# Altium schematic sheet LCD1602.SchDoc
size A3
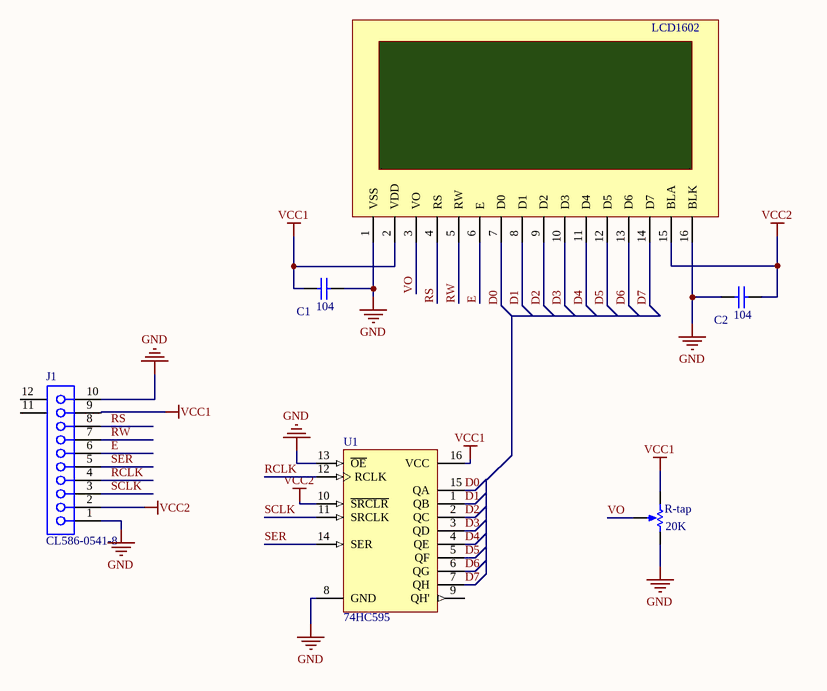
[diagram p0: LCD1602.SchDoc]

## Parts
C1  value 104  [C0805]  (hidden comment: Cap)
C2  value 104  [C0805]  (hidden comment: Cap)
J1  CL586-0541-8  [FH12-22(10)SA-1SH]
LCD1  LCD1602  [LCD 1602 - cut]
R-tap  value 20K  [res-tap]  (hidden comment: RPot)
U1  74HC595  [SO16_N]

## Nets
GND: C1.2 C2.1 J1.1 J1.10 LCD1.1(VSS) LCD1.16(BLK) R-tap.3(TAP) U1.8(GND) U1.13(~{OE})
VCC1: C1.1 J1.9 LCD1.2(VDD) R-tap.1(TOP) U1.16(VCC)
VCC2: C2.2 J1.2 LCD1.15(BLA) U1.10(~{SRCLR})
D0: LCD1.7(D0) U1.15(QA)
D1: LCD1.8(D1) U1.1(QB)
D2: LCD1.9(D2) U1.2(QC)
D3: LCD1.10(D3) U1.3(QD)
D4: LCD1.11(D4) U1.4(QE)
D5: LCD1.12(D5) U1.5(QF)
D6: LCD1.13(D6) U1.6(QG)
D7: LCD1.14(D7) U1.7(QH)
E: J1.6 LCD1.6(E)
RCLK: J1.4 U1.12(RCLK)
RS: J1.8 LCD1.4(RS)
RW: J1.7 LCD1.5(RW)
SCLK: J1.3 U1.11(SRCLK)
SER: J1.5 U1.14(SER)
VO: LCD1.3(VO) R-tap.2(BOT)

Not connected (* = marked no-connect by the designer): J1 11(MH1) 12(MH2); U1 9(QH')

## Library data of the parts
C1 C2 = Cap: Capacitor; Published: 8-Jun-2000; LatestRevisionDate: 17-Jul-2002; LatestRevisionNote: Re-released for DXP Platform.; PackageReference: RAD-0.3; Publisher: Altium Limited; PackageDescription: Radial Cap, Thru-Hole; 2 Leads; 0.3 in Pin Spacing
J1 = CL586-0541-8: FH12 Series, "Flip-Lock" SMT/ZIF FFC/FPC Connector - 1.0mm Spaced Bottom Eccentric Contact; Positions: 10; ContactMaterial: Phosphor Bronze; Current: 0.5A; PCB_Layout: Complies with manufacturer's recommendation.; Note: Pad dimensions follow nominal values, Suitable for Wave Soldering, Adjust for Re-flow.; Published: 17-Jul-2002; DatasheetVersion: 13-Nov-2000; PackageVersion: 13-Nov-2000; PackageReference: FH12-22(10)SA-1SH; Publisher: Altium Limited; ComponentLink1Description: Manufacturer Link; ComponentLink1URL: http://www.hiroseusa.com/; ComponentLink2Description: Datasheet; ComponentLink2URL: http://www.hirose.co.jp/cataloge_hp/e58605370.pdf
R-tap = RPot: Potentiometer; Sim Note: Enter the Resistance value and the set point into parameter fields.; Set Position: 0.5; Published: 8-Jun-2000; LatestRevisionDate: 17-Jul-2002; LatestRevisionNote: Re-released for DXP Platform.; PackageReference: VR5; Publisher: Altium Limited; PackageDescription: Variable Resistor, Thru-Hole; 3 Leads
U1 = M74HC595B1R: 8 Bit Shift Register with Output Latches (3 STATE); Published: 8-Jun-2000; LatestRevisionDate: 06-Jun-2005; LatestRevisionNote: Stylized 3D Model Added.; DatasheetVersion: Apr-1993; PackageVersion: Apr-1996; PackageReference: DIP16; Publisher: Altium Limited; PackageDescription: DIP; 16 Leads; Row Spacing 7.62 mm; Pitch 2.54 mm; ComponentLink1Description: Manufacturer Link; ComponentLink1URL: http://www.st.com/; ComponentLink2Description: Datasheet; ComponentLink2URL: http://www.st.com/stonline/products/literature/ds/1989/m74hc595.pdf